# EAGLE schematic quad_cape (EAGLE 6.1)
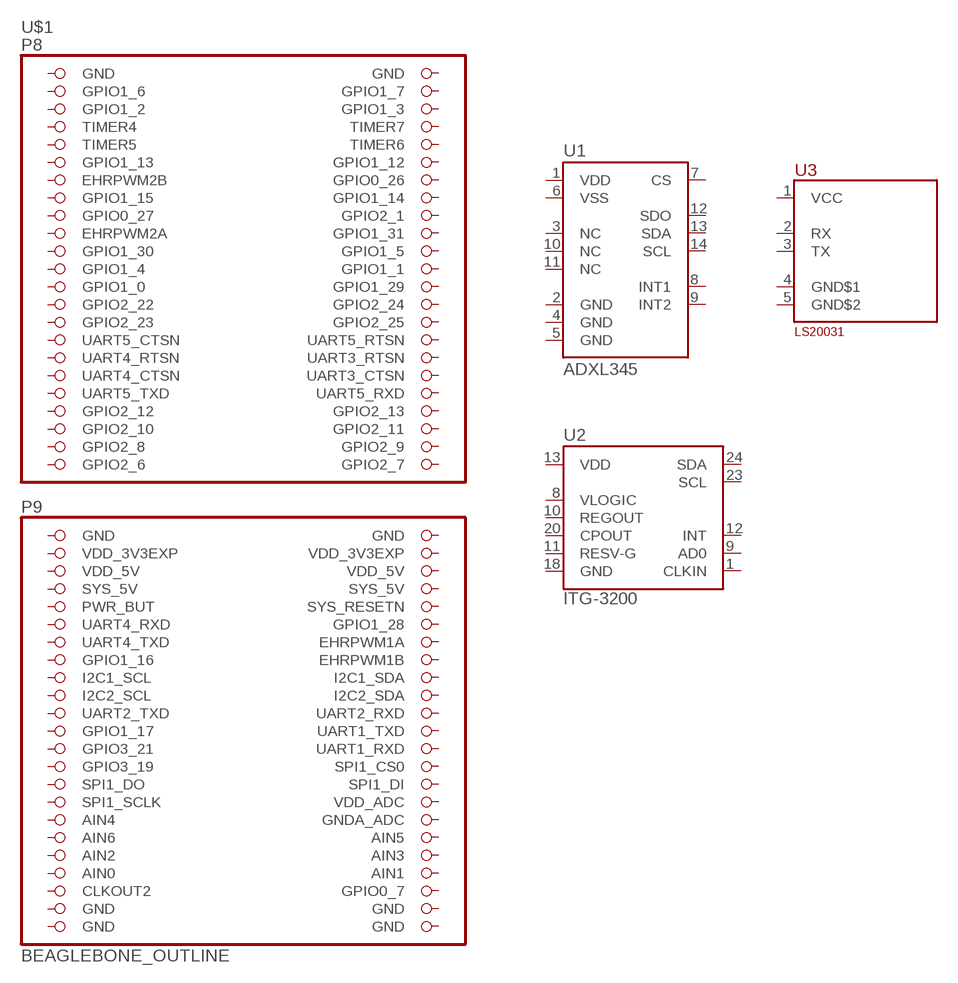
[diagram p0: schematic, sheet 1]

## Parts
U1  ADXL345  [LGA14]
U2  ITG-3200  [QFN-24]
U3  LS20031  [LS20031]
U$1  BEAGLEBONE_OUTLINE  [BEAGLEBONE_SHIELD]
Unconnected: U1.1(VDD) U1.2(GND) U1.3(NC) U1.4(GND) U1.5(GND) U1.6(VSS) U1.7(CS) U1.8(INT1) U1.9(INT2) U1.10(NC) U1.11(NC) U1.12(SDO) U1.13(SDA) U1.14(SCL) U2.1(CLKIN) U2.8(VLOGIC) U2.9(AD0) U2.10(REGOUT) U2.11(RESV-G) U2.12(INT) U2.13(VDD) U2.18(GND) U2.20(CPOUT) U2.23(SCL) U2.24(SDA) U3.2(RX) U3.3(TX) U$1.5(GPIO1_2) U$1.6(GPIO1_3) U$1.7(TIMER4) U$1.8(TIMER7) U$1.9(TIMER5) U$1.10(TIMER6) U$1.11(GPIO1_13) U$1.12(GPIO1_12) U$1.13(EHRPWM2B) U$1.14(GPIO0_26) U$1.15(GPIO1_15) U$1.16(GPIO1_14) U$1.17(GPIO0_27) U$1.18(GPIO2_1) U$1.19(EHRPWM2A) U$1.20(GPIO1_31) U$1.21(GPIO1_30) U$1.22(GPIO1_5) U$1.23(GPIO1_4) U$1.24(GPIO1_1) U$1.25(GPIO1_0) U$1.26(GPIO1_29) U$1.27(GPIO2_22) U$1.28(GPIO2_24) U$1.29(GPIO2_23) U$1.30(GPIO2_25) U$1.31(UART5_CTSN) U$1.32(UART5_RTSN) U$1.33(UART4_RTSN) U$1.34(UART3_RTSN) U$1.35(UART4_CTSN) U$1.36(UART3_CTSN) U$1.37(UART5_TXD) U$1.38(UART5_RXD) U$1.39(GPIO2_12) U$1.40(GPIO2_13) U$1.41(GPIO2_10) U$1.53(SYS_5V) U$1.54(SYS_5V) U$1.55(PWR_BUT) U$1.56(SYS_RESETN) U$1.57(UART4_RXD) U$1.58(GPIO1_28) U$1.59(UART4_TXD) U$1.60(EHRPWM1A) U$1.61(GPIO1_16) U$1.62(EHRPWM1B) U$1.63(I2C1_SCL) U$1.64(I2C1_SDA) U$1.65(I2C2_SCL) U$1.66(I2C2_SDA) U$1.67(UART2_TXD) U$1.68(UART2_RXD) U$1.69(GPIO1_17) U$1.70(UART1_TXD) U$1.71(GPIO3_21) U$1.72(UART1_RXD) U$1.73(GPIO3_19) U$1.74(SPI1_CS0) U$1.75(SPI1_DO) U$1.76(SPI1_DI) U$1.77(SPI1_SCLK) U$1.78(VDD_ADC) U$1.79(AIN4) U$1.80(GNDA_ADC) U$1.81(AIN6) U$1.82(AIN5) U$1.83(AIN2) U$1.86(AIN1) U$1.87(CLKOUT2) U$1.88(GPIO0_7) U$1.89(GND) U$1.90(GND) U$1.91(GND) U$1.92(GND)

## Power pins joined to a net without a drawn wire
AIN0: U$1.85(AIN0)
AIN3: U$1.84(AIN3)
GND: U$1.1(GND) U$1.2(GND) U$1.47(GND) U$1.48(GND)
GND$1: U3.4(GND$1)
GND$2: U3.5(GND$2)
GPIO1_6: U$1.3(GPIO1_6)
GPIO1_7: U$1.4(GPIO1_7)
GPIO2_6: U$1.45(GPIO2_6)
GPIO2_7: U$1.46(GPIO2_7)
GPIO2_8: U$1.43(GPIO2_8)
GPIO2_9: U$1.44(GPIO2_9)
GPIO2_11: U$1.42(GPIO2_11)
VCC: U3.1(VCC)
VDD_3V3EXP: U$1.49(VDD_3V3EXP) U$1.50(VDD_3V3EXP)
VDD_5V: U$1.51(VDD_5V) U$1.52(VDD_5V)

## Library data of the parts
U1 = SparkFun-Sensors:ADXL345: 3-axis SPI/I2C 2/4/8/16g accelerometer
U2 = SparkFun-Sensors:ITG-3200: ITG-3200 3-axis gyro, digital output, qfn24 package
U3 = custom:LS20031: 66 Channel LS20031 GPS 5Hz Receiver
U$1 = adafruit:BEAGLEBONE_OUTLINE: Should match A3 pinout - but not completely tested